# Altium project PCB.PrjPcb (part 2 of 2)

## Sheet Accelerometer.SchDoc: Accelerometer
size B; Date: 2015-01-30; Author: Marcin Czajkowski; Organization: Marcin Czajkowski; Address1: SN:3547684; Address2: ESE-Year2; Address3: Conestoga College; Address4: Project IV; DocumentNumber: 1; Revision: A; SheetNumber: 11; SheetTotal: 14
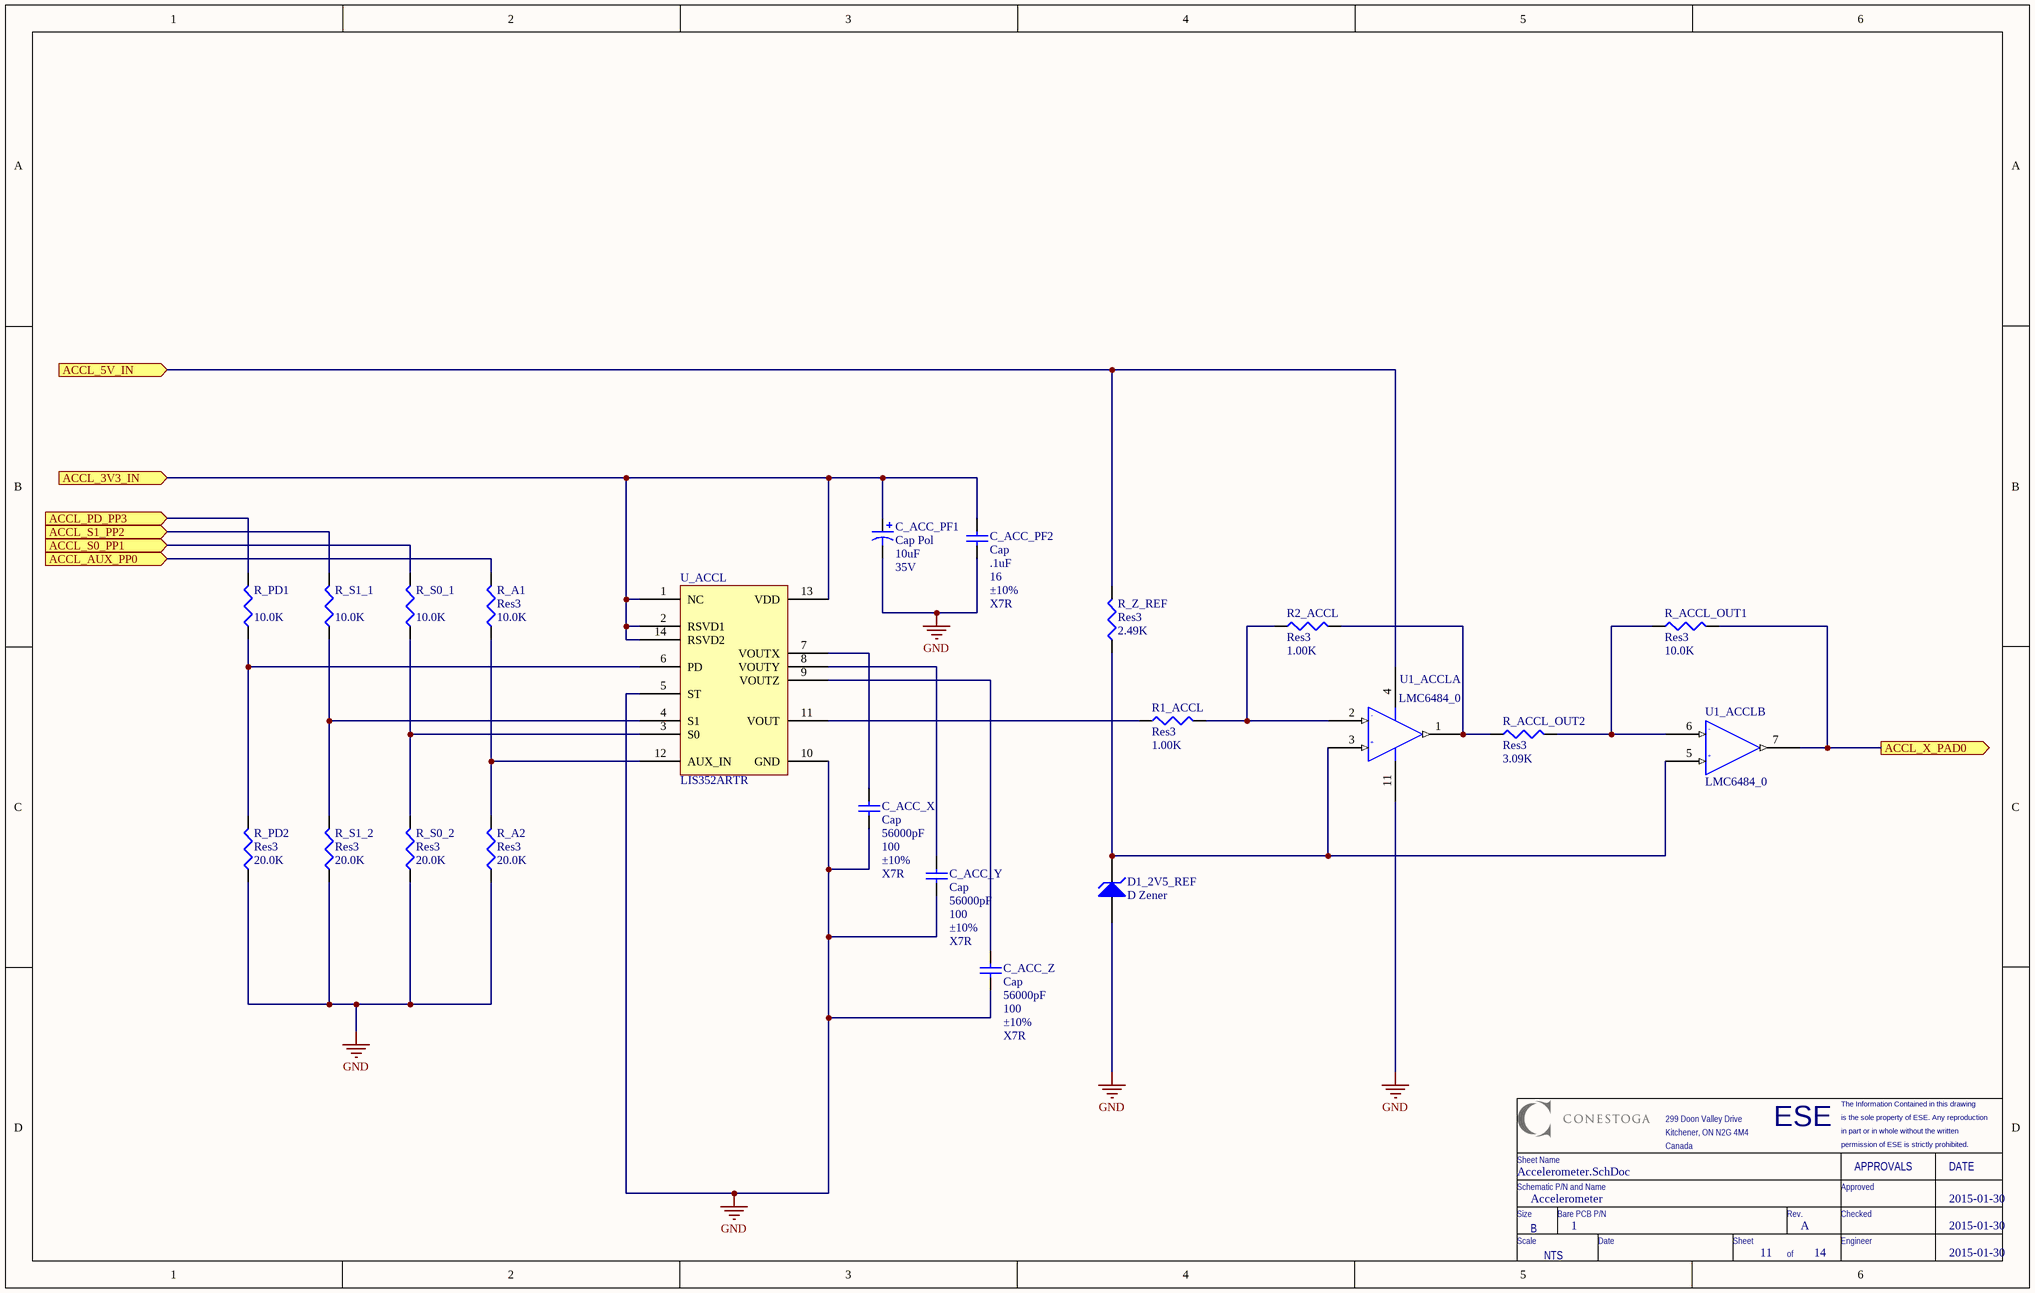
[diagram p10: Accelerometer.SchDoc]

### Parts
C_ACC_PF1  Cap Pol  value 10uF  Voltage: 35V  [CAPACITOR_5MM]
C_ACC_PF2  Cap  value .1uF  WV: 16  Tolerance: ±10%  Type: X7R  [CAPC2012X09M]
C_ACC_X  Cap  value 56000pF  WV: 100  Tolerance: ±10%  Type: X7R  [CAPC2012X09M]
C_ACC_Y  Cap  value 56000pF  WV: 100  Tolerance: ±10%  Type: X7R  [CAPC2012X09M]
C_ACC_Z  Cap  value 56000pF  WV: 100  Tolerance: ±10%  Type: X7R  [CAPC2012X09M]
D1_2V5_REF  D Zener
R1_ACCL  Res3  value 1.00K  [RESC2112X05M]
R2_ACCL  Res3  value 1.00K  [RESC2112X05M]
R_A1  Res3  value 10.0K  [RESC2112X05M]
R_A2  Res3  value 20.0K  [RESC2112X05M]
R_ACCL_OUT1  Res3  value 10.0K  [RESC2112X05M]
R_ACCL_OUT2  Res3  value 3.09K  [RESC2112X05M]
R_PD1  value 10.0K  [RESC2112X05M]  (hidden comment: Res3)
R_PD2  Res3  value 20.0K  [RESC2112X05M]
R_S0_1  value 10.0K  [RESC2112X05M]  (hidden comment: Res3)
R_S0_2  Res3  value 20.0K  [RESC2112X05M]
R_S1_1  value 10.0K  [RESC2112X05M]  (hidden comment: Res3)
R_S1_2  Res3  value 20.0K  [RESC2112X05M]
R_Z_REF  Res3  value 2.49K  [RESC2112X05M]
U1_ACCL  LMC6484_0  [SOIC127P600X175-14M-NS]  (parts A,B of 4)
U_ACCL  LIS352ARTR  [LGA-14-3X5MM]

### Ports
ACCL_3V3_IN (in), ACCL_5V_IN (in), ACCL_AUX_PP0 (in), ACCL_PD_PP3 (in), ACCL_S0_PP1 (in), ACCL_S1_PP2 (in), ACCL_X_PAD0 (out)

### Nets
GND: C_ACC_PF1.2 C_ACC_PF2.1 C_ACC_X.1 C_ACC_Y.1 C_ACC_Z.1 D1_2V5_REF.1(A) R_A2.1 R_PD2.1 R_S0_2.1 R_S1_2.1 U1_ACCL.11(-VCC) U_ACCL.5(ST) U_ACCL.10(GND)
NetC_ACC_PF1_1: C_ACC_PF1.1 C_ACC_PF2.2 U_ACCL.1(NC) U_ACCL.2(RSVD1) U_ACCL.13(VDD) U_ACCL.14(RSVD2) ; port ACCL_3V3_IN
NetC_ACC_X_2: C_ACC_X.2 U_ACCL.7(VOUTX)
NetC_ACC_Y_2: C_ACC_Y.2 U_ACCL.8(VOUTY)
NetC_ACC_Z_2: C_ACC_Z.2 U_ACCL.9(VOUTZ)
NetD1_2V5_REF_2: D1_2V5_REF.2(K) R_Z_REF.1 U1_ACCL.3(NINVIN_1) U1_ACCL.5(NINVIN2)
NetR1_ACCL_1: R1_ACCL.1 U_ACCL.11(VOUT)
NetR1_ACCL_2: R1_ACCL.2 R2_ACCL.1 U1_ACCL.2(INVIN_1)
NetR2_ACCL_2: R2_ACCL.2 R_ACCL_OUT2.1 U1_ACCL.1(OUT1)
NetR_A1_1: R_A1.1 R_A2.2 U_ACCL.12(AUX_IN)
NetR_A1_2: R_A1.2 ; port ACCL_AUX_PP0
NetR_ACCL_OUT1_1: R_ACCL_OUT1.1 R_ACCL_OUT2.2 U1_ACCL.6(INVIN2)
NetR_ACCL_OUT1_2: R_ACCL_OUT1.2 U1_ACCL.7(OUT2) ; port ACCL_X_PAD0
NetR_PD1_1: R_PD1.1 R_PD2.2 U_ACCL.6(PD)
NetR_PD1_2: R_PD1.2 ; port ACCL_PD_PP3
NetR_S0_1_1: R_S0_1.1 R_S0_2.2 U_ACCL.3(S0)
NetR_S0_1_2: R_S0_1.2 ; port ACCL_S0_PP1
NetR_S1_1_1: R_S1_1.1 R_S1_2.2 U_ACCL.4(S1)
NetR_S1_1_2: R_S1_1.2 ; port ACCL_S1_PP2
NetR_Z_REF_2: R_Z_REF.2 U1_ACCL.4(VCC) ; port ACCL_5V_IN

### Notes on the sheet
- ESE
- is the sole property of ESE. Any reproduction
- The Information Contained in this drawing
- Schematic P/N and Name
- Sheet Name
- 299 Doon Valley Drive
- Kitchener, ON N2G 4M4
- Canada
- Approved
- in part or in whole without the written
- permission of ESE is strictly prohibited.
- APPROVALS
- DATE
- Size
- Scale
- B
- NTS
- Bare PCB P/N
- Date
- Sheet
- Rev.
- Checked
- Engineer
- of
- (in symbol LMC6484_0, part A) -; +
- (in symbol LMC6484_0, part B) -; +

### Library data of the parts
C_ACC_PF1 = Cap Polar-10uF-35V: CAP 85C 10uF ±20% 35V WX Series Aluminum Electrolytic; MPN: UWX1V100MCL1GB; Tan Theta: 0.12; Leakage Current: 3.5; Rated Ripple Current: 29; PN: 493-2117-1-ND; Name: Cap Polar-10uF-35V; Diameter: 5; URL: http://www.digikey.ca/product-detail/en/UWX1V100MCL1GB/493-2117-1-ND
C_ACC_PF2 = CAP-X7R-.1uF-16V-±10%: CAP CER .1uF 16v X7R 0805; MPN: C0805C104K4RACTU; PN: 399-1167-1-ND; Name: CAP-X7R-.1uF-16V-±10%; URL: http://www.digikey.ca/product-detail/en/C0805C104K4RACTU/399-1167-1-ND
C_ACC_X C_ACC_Y C_ACC_Z = CAP-X7R-56000pF-100V-±10%: CAP CER 56000pF 100v X7R 0805; MPN: C0805C563K1RACTU; PN: 399-3483-1-ND; Name: CAP-X7R-56000pF-100V-±10%; URL: http://www.digikey.ca/product-detail/en/C0805C563K1RACTU/399-3483-1-ND
D1_2V5_REF = D Zener: Zener Diode; Digikey_Web: http://www.digikey.ca/product-detail/en/MMSZ5222BT1G/MMSZ5222BT1GOSCT-ND/1967177; Digikey#: MMSZ5222BT1GOSCT-ND
R1_ACCL R2_ACCL = Resistor_1.00K: RES SMD 1.00K OHM 1% 1/8W 0805; MPN: CRCW08051K00FKEA; PN: 541-1.00KCCT-ND; Name: Resistor_1.00K; URL: http://www.digikey.ca/product-detail/en/CRCW08051K00FKEA/541-1.00KCCT-ND
R_A1 R_ACCL_OUT1 R_PD1 R_S0_1 R_S1_1 = Resistor_10.0K: RES SMD 10.0K OHM 1% 1/8W 0805; MPN: CRCW080510K0FKEA; PN: 541-10.0KCCT-ND; Name: Resistor_10.0K; URL: http://www.digikey.ca/product-detail/en/CRCW080510K0FKEA/541-10.0KCCT-ND
R_A2 R_PD2 R_S0_2 R_S1_2 = Resistor_20.0K: RES SMD 20.0K OHM 1% 1/8W 0805; MPN: CRCW080520K0FKEA; PN: 541-20.0KCCT-ND; Name: Resistor_20.0K; URL: http://www.digikey.ca/product-detail/en/CRCW080520K0FKEA/541-20.0KCCT-ND
R_ACCL_OUT2 = Resistor_3.09K: RES SMD 3.09K OHM 1% 1/8W 0805; MPN: CRCW08053K09FKEA; PN: 541-3.09KCCT-ND; Name: Resistor_3.09K; URL: http://www.digikey.ca/product-detail/en/CRCW08053K09FKEA/541-3.09KCCT-ND
R_Z_REF = Resistor_2.49K: RES SMD 2.49K OHM 1% 1/8W 0805; MPN: CRCW08052K49FKEA; PN: 541-2.49KCCT-ND; Name: Resistor_2.49K; URL: http://www.digikey.ca/product-detail/en/CRCW08052K49FKEA/541-2.49KCCT-ND
U1_ACCL = LMC6484_0: IC OPAMP GP 1.5MHZ RRO 14SOIC; MPN: LMC6484IMX/NOPB; PN: LMC6484IMX/NOPBCT-ND; URL: http://www.digikey.ca/product-detail/en/LMC6484IMX%2FNOPB/LMC6484IMX%2FNOPBCT-ND
U_ACCL = LIS352AR: IC ACCELEROMETER 3AXIS LP 14LGA; PN: 497-11075-1-ND; MPN: LIS352ARTR; URL: http://www.digikey.ca/product-detail/en/LIS352ARTR/497-11075-1-ND

## Sheet DAC.SchDoc: DAC
size B; Date: 2015-01-30; Author: Marcin Czajkowski; Organization: Marcin Czajkowski; Address1: SN:3547684; Address2: ESE-Year2; Address3: Conestoga College; Address4: Project IV; DocumentNumber: 1; Revision: A; SheetNumber: 12; SheetTotal: 14
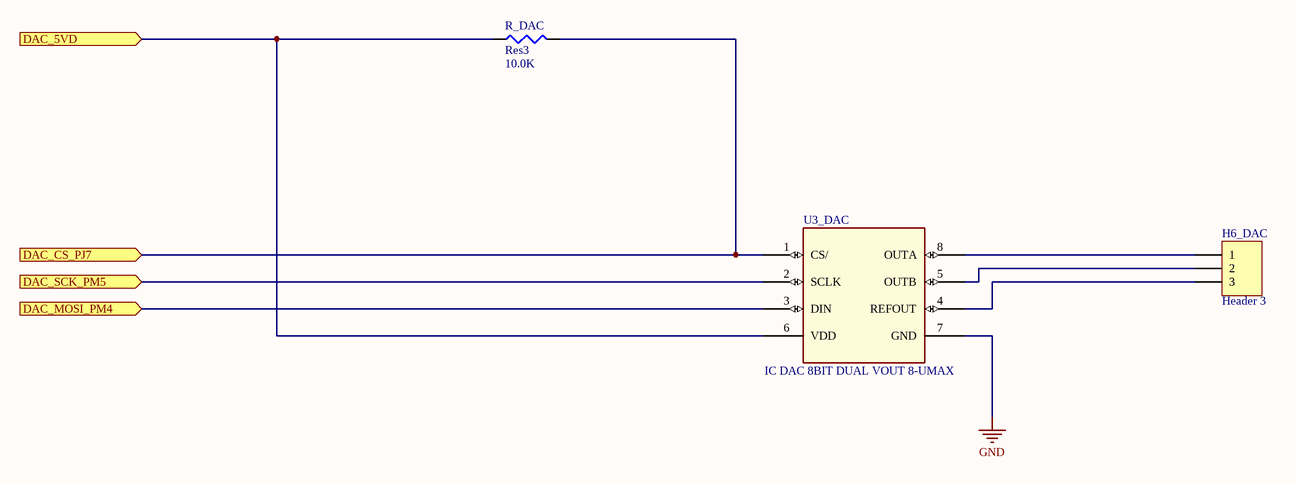
[diagram p11: DAC.SchDoc]

### Parts
H6_DAC  Header 3  [HDR1X3]
R_DAC  Res3  value 10.0K  [RESC2112X05M]
U3_DAC  IC DAC 8BIT DUAL VOUT 8-UMAX  [TSOP65P490X110-8M]

### Ports
DAC_5VD (in), DAC_CS_PJ7 (in), DAC_MOSI_PM4 (in), DAC_SCK_PM5 (in)

### Nets
GND: U3_DAC.7(GND)
NetH6_DAC_1: H6_DAC.1 U3_DAC.8(OUTA)
NetH6_DAC_2: H6_DAC.2 U3_DAC.5(OUTB)
NetH6_DAC_3: H6_DAC.3 U3_DAC.4(REFOUT)
NetR_DAC_1: R_DAC.1 U3_DAC.6(VDD) ; port DAC_5VD
NetR_DAC_2: R_DAC.2 U3_DAC.1(CS/) ; port DAC_CS_PJ7
NetU3_DAC_2: U3_DAC.2(SCLK) ; port DAC_SCK_PM5
NetU3_DAC_3: U3_DAC.3(DIN) ; port DAC_MOSI_PM4

### Notes on the sheet
- ESE
- is the sole property of ESE. Any reproduction
- The Information Contained in this drawing
- Schematic P/N and Name
- Sheet Name
- 299 Doon Valley Drive
- Kitchener, ON N2G 4M4
- Canada
- Approved
- in part or in whole without the written
- permission of ESE is strictly prohibited.
- APPROVALS
- DATE
- Size
- Scale
- B
- NTS
- Bare PCB P/N
- Date
- Sheet
- Rev.
- Checked
- Engineer
- of

### Library data of the parts
H6_DAC = Header 3: Header, 3-Pin; LatestRevisionDate: 17-Jul-2002; LatestRevisionNote: Re-released for DXP Platform.; Publisher: Altium Limited
R_DAC = Resistor_10.0K: as R_A1 on sheet Accelerometer; Name: Resistor_10.0K; URL: http://www.digikey.ca/product-detail/en/CRCW080510K0FKEA/541-10.0KCCT-ND
U3_DAC = Max5513-dac: MPN: MAX5513EUA+; PN: MAX5513EUA+-ND; URL: http://www.digikey.ca/product-detail/en/MAX5513EUA%2B/MAX5513EUA%2B-ND

## Nets that join several sheets
GND: SMPS_5V_D (7 pins), SMPS_5V_A (7 pins), Hierarchical_Design (V_BAT1.2 V_BAT2.2), CPU (29 pins), RS3232 (9 pins), StepperMotor1CTRL (14 pins), LCD_Header (H4_LCDHeader.1 H4_LCDHeader.16 R_Cont.3), DCMotor1CTRL (10 pins), Encoder_DC_Mot (5 pins), LVR_3V3_PS (C_in_LVR_5VD.2 Cout_LVR3V3.2 U1_LVR_3V3.1), Accelerometer (13 pins), DAC (U3_DAC.7)
NetQ_RX_1: CPU (U_CPU1.64), RS3232 (Q_RX.1 U_SER1.12)
NetQ_TX_1: CPU (U_CPU1.63), RS3232 (Q_TX.1 U_SER1.11)